# Altium schematic sheet SCH_A3_TempColored.SchDoc
size A3
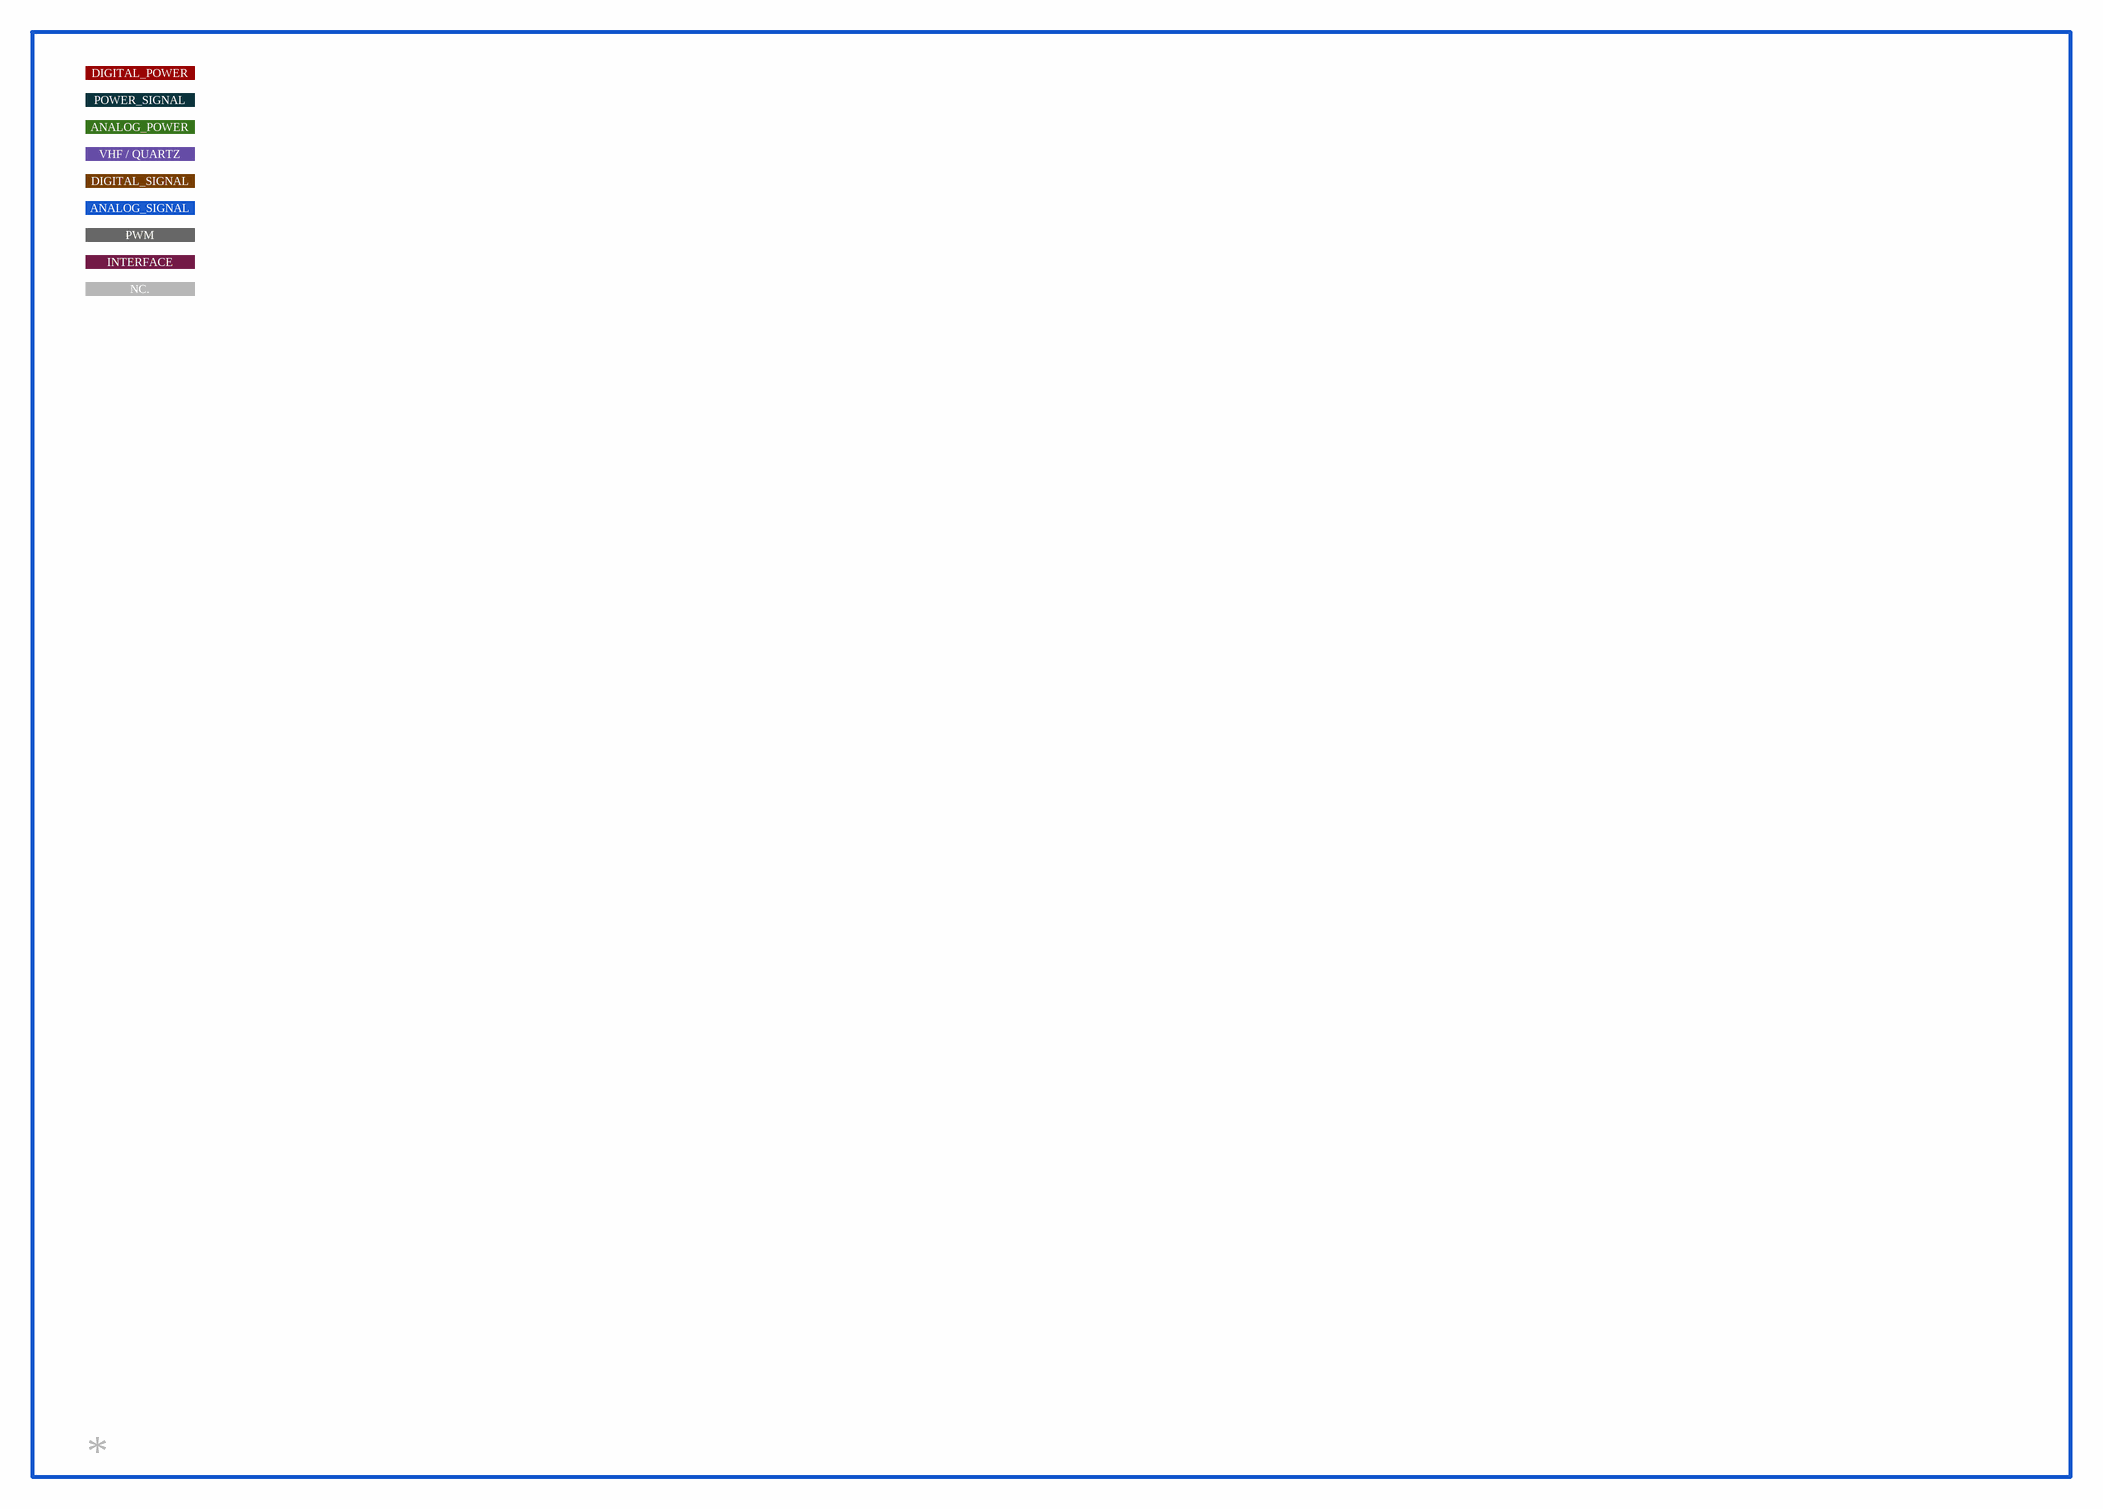
[diagram p0: SCH_A3_TempColored.SchDoc]

## Ports
ANALOG_POWER, ANALOG_SIGNAL, DIGITAL_POWER, DIGITAL_SIGNAL, INTERFACE, NC., POWER_SIGNAL, PWM, VHF / QUARTZ